# EAGLE design tpa6120-v1_0_0_0-optim (EAGLE 6.4)
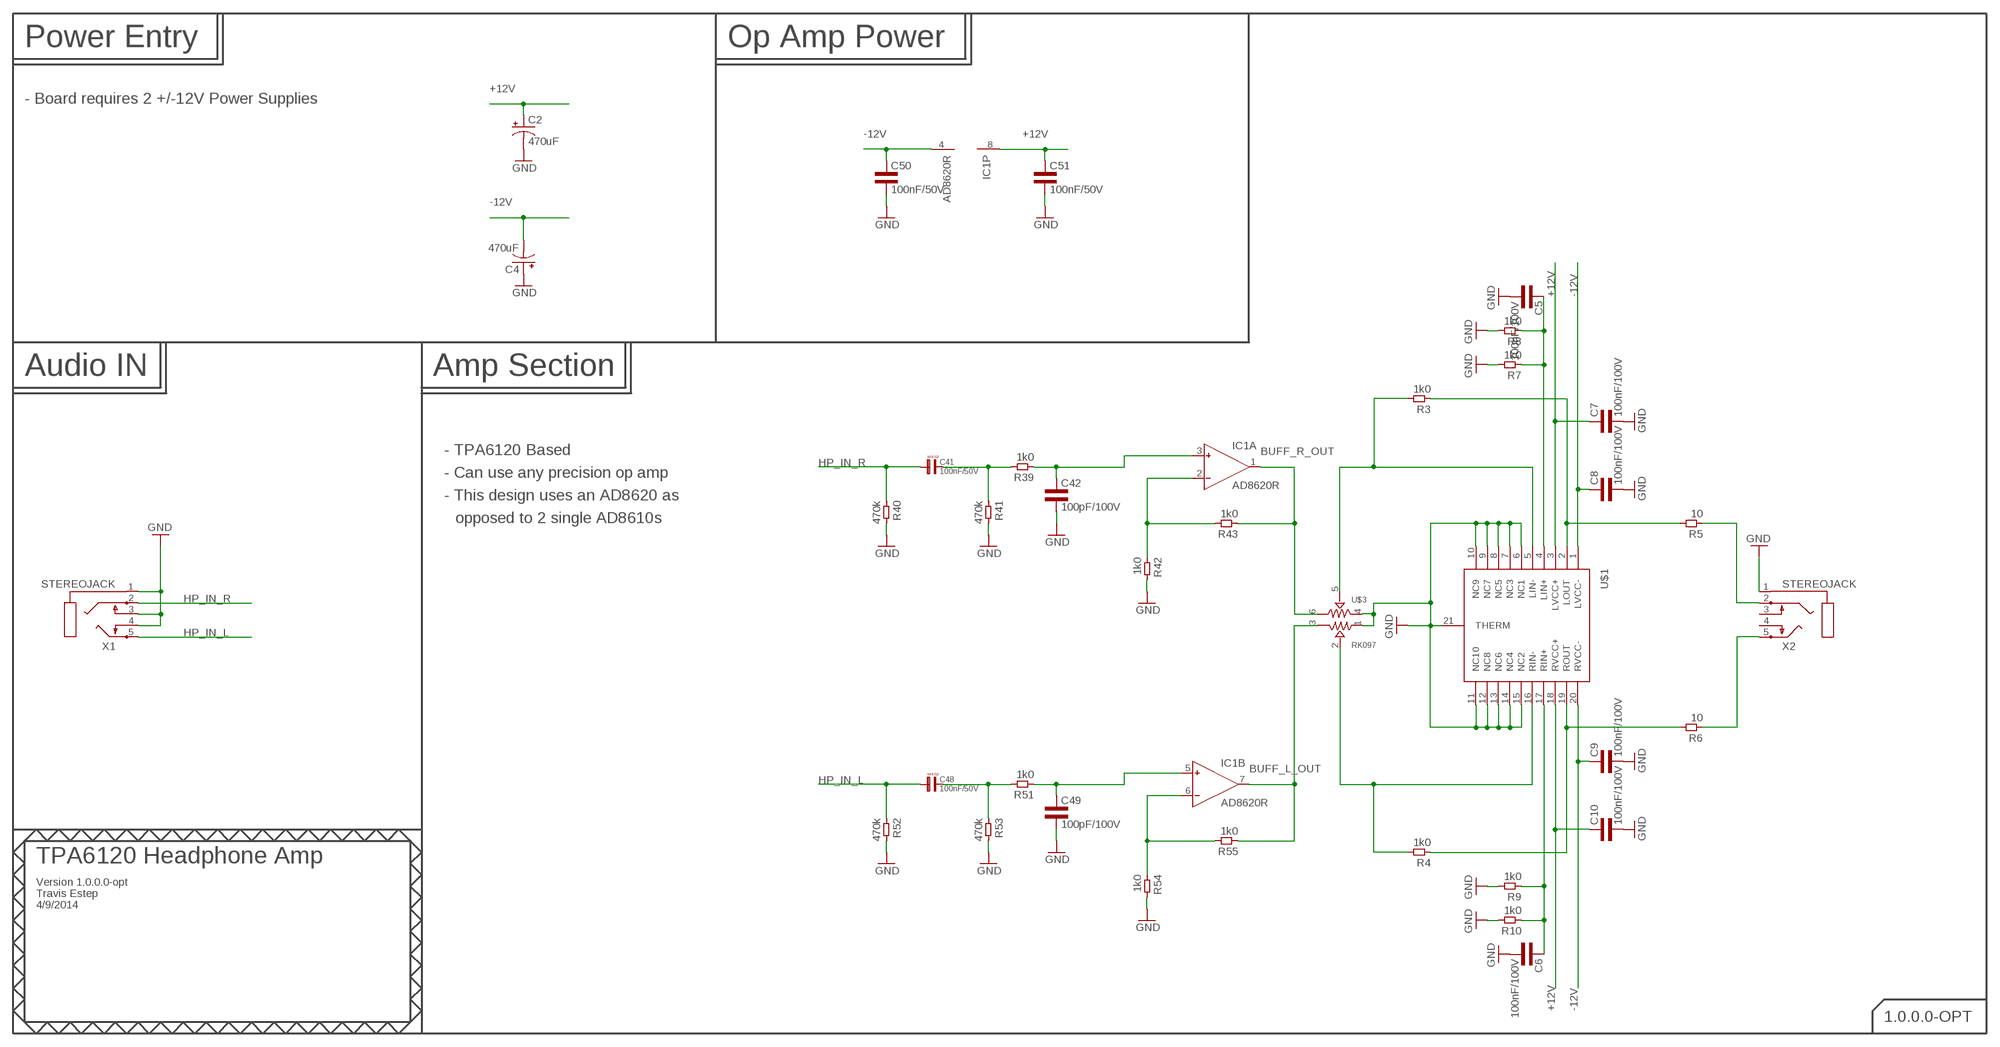
[diagram p0: schematic, sheet 1]

## Parts
C2  470uF  CPOL-USE5-10.5  [E5-10,5]
C4  470uF  CPOL-USE5-10.5  [E5-10,5]
C5  100nF/100V  CAP0603L3  [0603L3]
C6  100nF/100V  CAP0603L3  [0603L3]
C7  100nF/100V  CAP0603L3  [0603L3]
C8  100nF/100V  CAP0603L3  [0603L3]
C9  100nF/100V  CAP0603L3  [0603L3]
C10  100nF/100V  CAP0603L3  [0603L3]
C41  100nF/50V  0,1µF  [R5B2K5]
C42  100pF/100V  CAP0603L3  [0603L3]
C48  100nF/50V  0,1µF  [R5B2K5]
C49  100pF/100V  CAP0603L3  [0603L3]
C50  100nF/50V  CAP0603L3  [0603L3]
C51  100nF/50V  CAP0603L3  [0603L3]
IC1  AD8620R  [SO8]
R3  1k0  RES0603L3  [0603L3]
R4  1k0  RES0603L3  [0603L3]
R5  10  RES1206L3  [1206L3]
R6  10  RES1206L3  [1206L3]
R7  1k0  RES0603L3  [0603L3]
R8  1k0  RES0603L3  [0603L3]
R9  1k0  RES0603L3  [0603L3]
R10  1k0  RES0603L3  [0603L3]
R39  1k0  RES0603L3  [0603L3]
R40  470k  RES0603L3  [0603L3]
R41  470k  RES0603L3  [0603L3]
R42  1k0  RES0603L3  [0603L3]
R43  1k0  RES0603L3  [0603L3]
R51  1k0  RES0603L3  [0603L3]
R52  470k  RES0603L3  [0603L3]
R53  470k  RES0603L3  [0603L3]
R54  1k0  RES0603L3  [0603L3]
R55  1k0  RES0603L3  [0603L3]
U$1  TPA6120_TPA6120  [TPA6120_TPA6120]
U$3  RK097  [RK097]
X1  STEREOJACK  [STX3100]
X2  STEREOJACK  [STX3100]

## Nets
+12V: C2.+ C7.P$1 C10.P$1 C51.P$1 IC1.8(P:V+) U$1.3(LVCC+) U$1.18(RVCC+)
-12V: C4.- C8.P$1 C9.P$1 C50.P$1 IC1.4(P:V-) U$1.1(LVCC-) U$1.20(RVCC-)
BUFF_L_OUT: IC1.7(B:OUT) R55.P$1 U$3.3
BUFF_R_OUT: IC1.1(A:OUT) R43.P$1 U$3.6
GND: C2.- C4.+ C5.P$2 C6.P$2 C7.P$2 C8.P$2 C9.P$2 C10.P$2 C42.P$2 C49.P$2 C50.P$2 C51.P$2 R7.P$2 R8.P$2 R9.P$2 R10.P$2 R40.P$2 R41.P$2 R42.P$2 R52.P$2 R53.P$2 R54.P$2 U$1.6(NC1) U$1.7(NC3) U$1.8(NC5) U$1.9(NC7) U$1.10(NC9) U$1.11(NC10) U$1.12(NC8) U$1.13(NC6) U$1.14(NC4) U$1.15(NC2) U$1.21(THERM) U$3.1 U$3.4 X1.1 X1.3 X1.4 X2.1
HP_IN_L: C48.1 R52.P$1 X1.5
HP_IN_R: C41.1 R40.P$1 X1.2
HP_OUT_L: R6.1 X2.5
HP_OUT_R: R5.1 X2.2
INVERT_L: R3.P$2 U$1.5(LIN-) U$3.5
INVERT_R: R4.P$2 U$1.16(RIN-) U$3.2
N$19: C5.P$1 R7.P$1 R8.P$1 U$1.4(LIN+)
N$20: C6.P$1 R9.P$1 R10.P$1 U$1.17(RIN+)
N$30: C41.2 R39.P$2 R41.P$1
N$31: C42.P$1 IC1.3(A:IN+) R39.P$1
N$32: IC1.2(A:IN-) R42.P$1 R43.P$2
N$39: C48.2 R51.P$2 R53.P$1
N$40: C49.P$1 IC1.5(B:IN+) R51.P$1
N$41: IC1.6(B:IN-) R54.P$1 R55.P$2
OUT_L: R4.P$1 R6.2 U$1.19(ROUT)
OUT_R: R3.P$1 R5.2 U$1.2(LOUT)
Unconnected: X2.3 X2.4

## Notes on the sheet
- Power Entry | Op Amp Power
- - Board requires 2 +/-12V Power Supplies
- Audio IN | Amp Section
- - TPA6120 Based
- - Can use any precision op amp
- - This design uses an AD8620 as
- opposed to 2 single AD8610s
- TPA6120 Headphone Amp
- Version 1.0.0.0-opt
- Travis Estep
- 4/9/2014
- 1.0.0.0-OPT

## Library data of the parts
C2 C4 = rcl:CPOL-US: POLARIZED CAPACITOR, American symbol
C5-C10 C42 C49-C51 = common:CAP
C41 C48 = Capacitor-Wima-MKS2-63v:0,1µF
IC1 = analog-devices:AD8620: Precision, Very Low Noise, Low Input Bias Current, Wide Bandwidth JFET Operational Amplifiers Source: http://www.analog.com/static/imported-files/data_sheets/AD8610_8620.pdf; MF: ALTERA CORPORATION; MPN: AD8620ARZ; OC_FARNELL: 9994386; OC_NEWARK: 59K6972
R3-R10 R39-R43 R51-R55 = common:RES
U$1 = amp:TPA6120_TPA6120
U$3 = SparkFun-Electromechanical:RK097
X1 X2 = adafruit:STEREOJACK: MIC/HEADPHONE JACK Stereo jack with two switches. Kycon STX3100, CUI SJ1-3555NG and/or 4UCon 05544

## Board
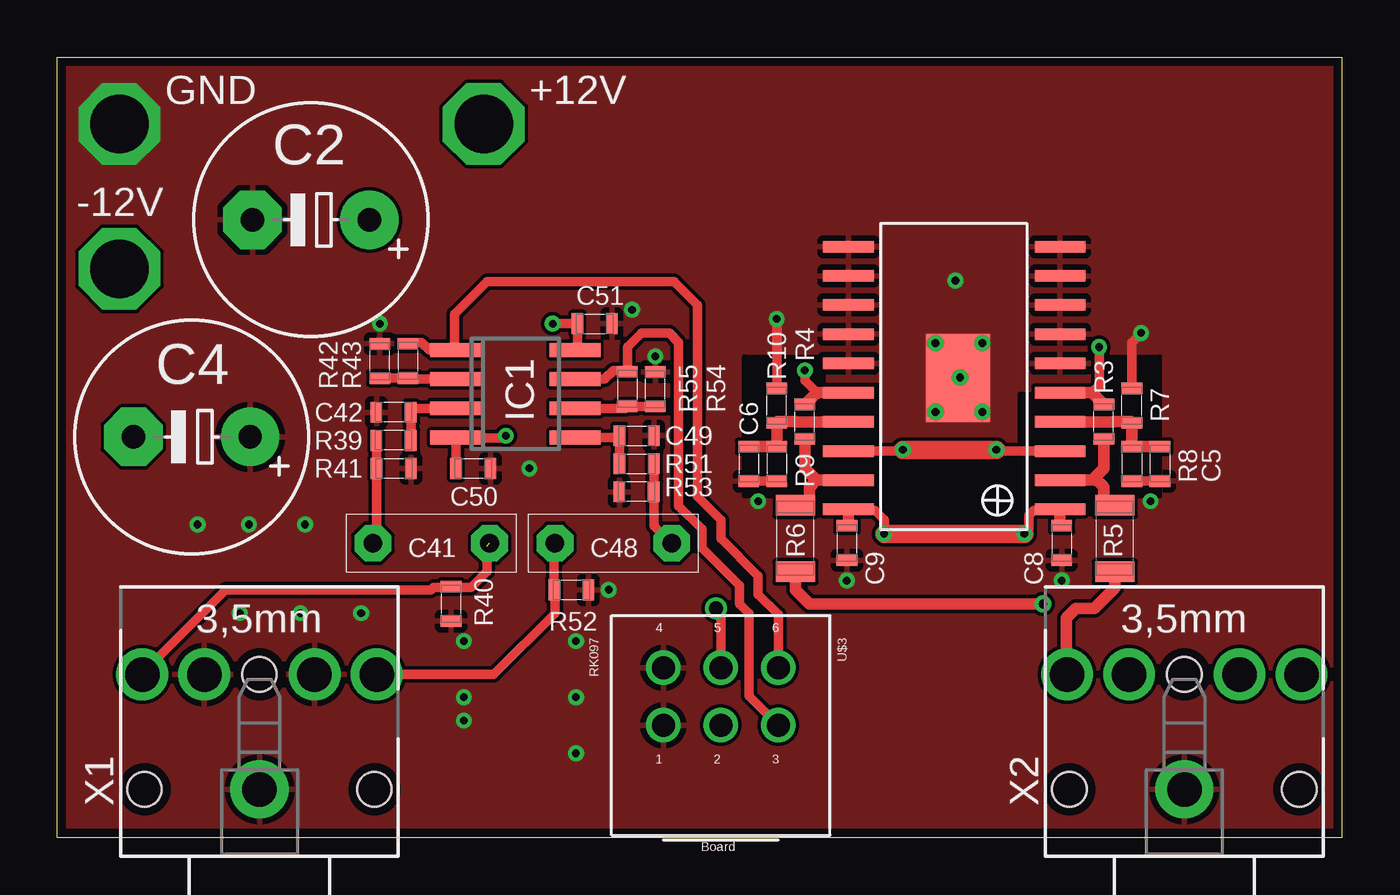
[diagram p1: board, top side]
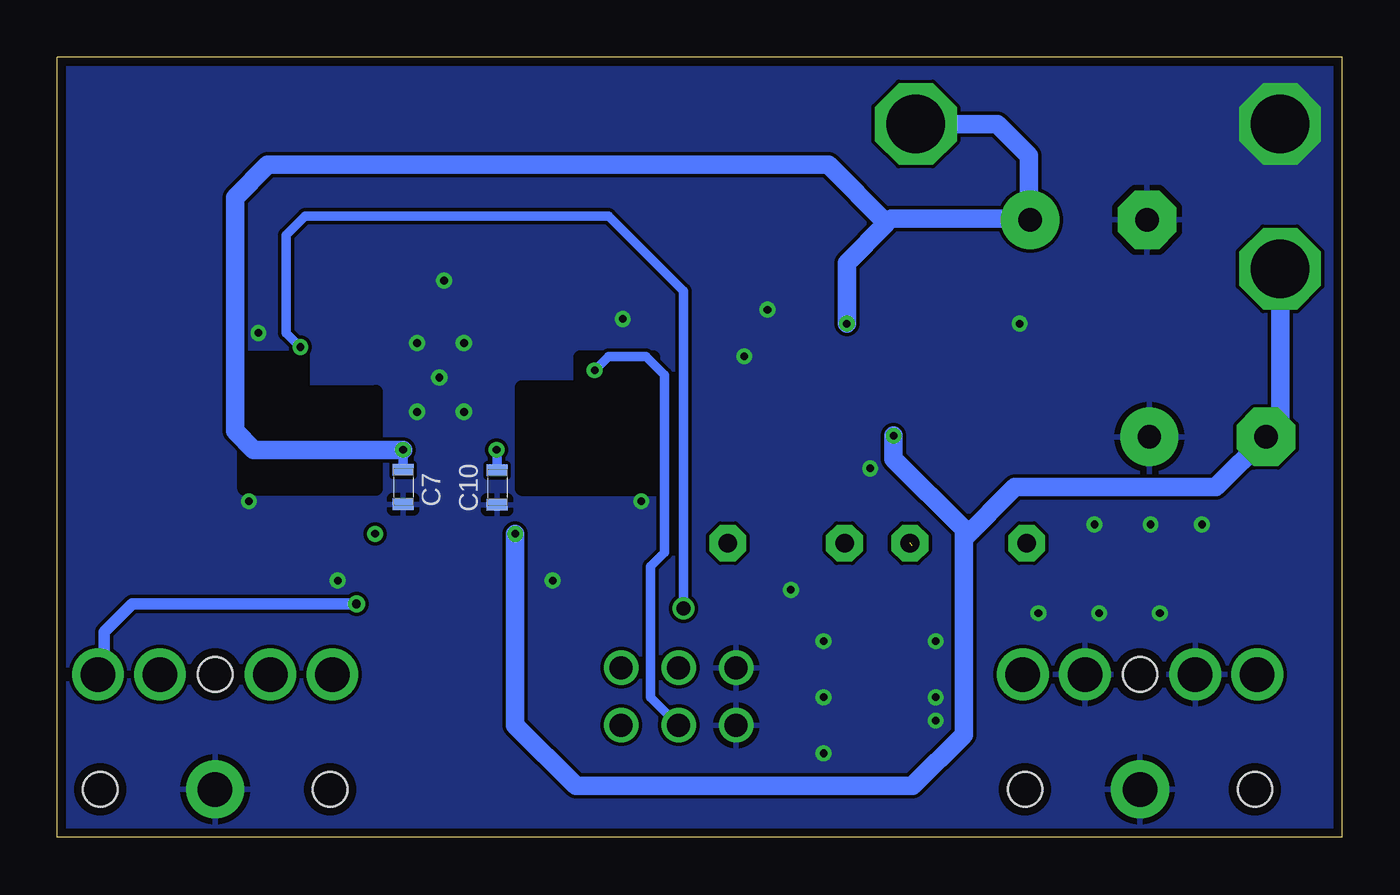
[diagram p2: board, bottom side, seen from below]

Size 55.88 x 33.93 mm. Coordinates in mm from the lower left corner, seen from the top.
Outline: 0,0 55.88,0 55.88,33.93 0,33.93 0,0
Copper layers (1*16): Top 0.0356mm / dielectric 1.5011mm / Bottom 0.0356mm
Design rules "LaenPCBOrder *": minimum track width 6mil, minimum drill 13mil, track to track 6mil, track to pad 6mil, pad to pad 6mil, via to via 6mil, smd to smd 6mil, copper to edge 15mil, drill to drill 6mil, minimum pad ring 7mil, minimum via ring 7mil, stop-mask expansion 3mil, vias tented up to drill 16mil, thermal gap 10mil
tRestrict: area 41.9,14.8 to 48,20.9; area 29.9,14.8 to 35.8,20.9
bRestrict: area 42,15.2 to 47.8,20.9; area 30,15.2 to 35.7,20.9

### Footprints (pad centres in the part's own frame; a part is rotated, then mirrored left to right if it is on the bottom)
E5-10,5 = drill 1.016 pad 2.54: + -2.54,0 | drill 1.016 pad 2.54 octagon: - 2.54,0
0603L3 = smd 0.5 x 0.9: P$1 -0.75,0; P$2 0.75,0
R5B2K5 = drill 0.813 pad 1.6 octagon: 1 -2.54,0; 2 2.54,0
SO8 = smd 0.6 x 2.2: 1 -1.905,-2.6; 2 -0.635,-2.6; 3 0.635,-2.6; 4 1.905,-2.6; 5 1.905,2.6; 6 0.635,2.6; 7 -0.635,2.6; 8 -1.905,2.6
1206L3 = smd 0.9 x 1.7: 1 -1.45,0; 2 1.45,0
TPA6120_TPA6120 = smd 0.5 x 2.2: 1 0.25,1.095; 2 1.52,1.095; 3 2.79,1.095; 4 4.06,1.095; 5 5.33,1.095; 6 6.6,1.095; 7 7.87,1.095; 8 9.14,1.095; 9 10.41,1.095; 10 11.68,1.095; 11 11.68,10.295; 12 10.41,10.295; 13 9.14,10.295; 14 7.87,10.295; 15 6.6,10.295; 16 5.33,10.295; 17 4.06,10.295; 18 2.79,10.295; 19 1.52,10.295; 20 0.25,10.295 | smd 3.81 x 2.79: 21 5.965,5.54
RK097 = drill 1: 1 2.5,0; 2 0,0; 3 -2.5,0; 4 2.5,-2.5; 5 0,-2.5; 6 -2.5,-2.5
STX3100 = drill 1.5 pad 2.54: 1 2.7,-0.1 | drill 1.5: 2 7.7,5; 3 7.7,2.3; 4 7.7,-2.5; 5 7.7,-5.2 | hole 1.5: 2.7,4.9; 2.7,-5.1; 7.7,-0.1

### Placement (x,y rotation side)
C2  11.02,26.87 180 top
C4  5.84,17.42 180 top
C5  47.96,16.26 270 top
C6  30.07,16.26 270 top
C7  40.84,15.24 270 bottom
C8  43.69,12.8 270 top
C9  34.34,12.8 270 top
C10  36.75,15.21 270 bottom
C41  16.26,12.8 180 top
C42  14.63,18.49 180 top
C48  24.18,12.8 0 top
C49  25.2,17.48 0 top
C50  18.08,16.05 0 top
C51  23.37,22.35 0 top
IC1  19.91,19.3 270 top
R3  45.52,18.08 90 top
R4  32.51,18.08 90 top
R5  46,13 90 top
R6  32.11,13 90 top
R7  46.74,18.8 90 top
R8  46.74,16.26 270 top
R9  31.29,16.26 270 top
R10  31.29,18.8 90 top
R39  14.63,17.27 180 top
R40  17.12,10.16 270 top
R41  14.63,16.05 0 top
R42  14.02,20.73 90 top
R43  15.24,20.73 270 top
R51  25.2,16.26 0 top
R52  22.35,10.77 0 top
R53  25.2,15.04 180 top
R54  26.01,19.51 90 top
R55  24.79,19.51 270 top
U$1  44.7,14.02 90 top
U$3  28.85,4.88 180 top
X1  8.69,-0.61 90 top
X2  48.92,-0.61 90 top

### Tracks (layer width: path | path; a pad name or v marks a point on that pad's centre or on a via)
+12V  (via drill 0.33, 2.54)
  Top 0.406: IC1.8 22.62,21.31 C51.P$1 v21.54,22.35 | U$1.18 36.73,16.81 v36.78,16.87 | U$1.3 40.9,16.81 v40.84,16.87
  Top 0.813: v36.78,16.87 v40.84,16.87
  Bottom 0.406: 13.61,26.92 C2.+ | C10.P$1 36.75,16.84 v36.78,16.87 | C7.P$1 v40.84,16.87
  Bottom 0.813: v18.54,31.04 14.99,31.04 13.61,29.67 13.61,26.92 19.61,26.92 19.81,26.72 | 19.81,26.72 21.54,24.99 v21.54,22.35 | v40.84,16.87 47.35,16.87 48.16,17.68 48.16,27.84 46.74,29.26 22.35,29.26 19.81,26.72
-12V  (via drill 0.33, 2.54)
  Top 0.406: C50.P$1 17.34,17.38 | 17.34,17.38 IC1.4 | 17.34,17.38 19.41,17.38 v19.51,17.48 | U$1.1 43.56,14.22 42.47,14.22 42.27,14.02 42.27,13.41 v42.06,13.21 | v35.97,13.21 35.97,13.82 35.56,14.22 34.46,14.22 U$1.20
  Top 0.508: U$1.20 34.41,13.62 C9.P$1 | U$1.1 43.61,13.63 C8.P$1
  Top 0.813: v42.06,13.21 v35.97,13.21
  Bottom 0.406: 3.25,17.48 C4.-
  Bottom 0.813: 16.46,13.01 14.22,15.24 5.49,15.24 C4.- 2.69,18.03 v2.69,24.74 | 16.46,13.01 16.46,4.47 18.69,2.24 33.33,2.24 35.97,4.88 v35.97,13.21 | 16.46,13.01 16.46,13.41 19.51,16.46 v19.51,17.48
BUFF_L_OUT
  Top 0.406: IC1.7 23.8,19.94 24.18,20.32 24.73,20.32 R55.P$1 24.79,21.34 25.4,21.95 26.62,21.95 27.03,21.54 27.03,14.43 28.04,13.41 28.04,12.6 29.67,10.97 29.67,10.16 30.07,9.75 30.07,6.16 U$3.3
BUFF_R_OUT
  Top 0.406: R43.P$1 15.3,21.54 15.85,21.54 16.18,21.21 IC1.1 17.27,21.25 17.27,22.76 18.69,24.18 26.82,24.18 27.84,23.17 27.84,14.83 28.85,13.82 28.85,13.01 30.48,11.38 30.48,10.57 31.35,9.69 U$3.6
GND  (via drill 0.33, 0.35, 2.54)
  Top 0.406: R8.P$2 C5.P$2 | R10.P$2 v31.29,22.56 | R7.P$2 46.74,21.54 v47.14,21.95 | C6.P$2 R9.P$2
  other vias: 38.2,21.51 38.2,18.52 40.23,18.52 40.23,21.51 39.07,24.23 39.27,20.02 2.69,31.04 26.01,20.93 34.34,11.18 43.69,11.18 6.1,13.61 8.33,13.61 10.77,13.61 7.92,9.75 10.57,9.75 13.21,9.75 17.68,8.53 23.98,10.77 30.48,14.63 20.52,16.05 17.68,6.1 17.68,5.08 22.56,8.53 22.56,6.1 22.56,3.66 47.55,14.63 14.02,22.35 24.99,22.96
  pour Top (no thermals): 37.19,22.56 41.45,22.56 41.45,17.68 37.19,17.68
  pour Bottom: 0.41,33.53 0.41,0.41 55.47,0.41 55.47,33.53
  pour Top: 0.41,33.53 0.41,0.41 55.47,0.41 55.47,33.53
HP_IN_L
  Top 0.406: X1.5 18.98,7.09 21.64,9.75 21.64,10.73 R52.P$1 21.6,12.74 C48.1
HP_IN_R  (1 unrouted)
  Top 0.406: X1.2 3.69,7.14 7.32,10.77 16.26,10.77 16.36,10.87 17.08,10.87 R40.P$1 17.16,10.87 17.98,10.87 18.68,11.57 18.68,12.69
HP_OUT_L  (via drill 0.38)
  Top 0.508: R6.1 32.11,10.77 32.72,10.16 v42.88,10.16
  Bottom 0.508: v42.88,10.16 52.63,10.16 53.85,8.94 53.85,7.36 X2.5
HP_OUT_R
  Top 0.508: R5.1 46,10.85 45.11,9.96 44.3,9.96 43.89,9.55 43.89,7.12 X2.2
INVERT_L  (via drill 0.33, 0.6)
  Top 0.406: U$3.5 28.85,9.75 v28.65,9.96 | v45.31,21.34 45.31,19.66 45,19.35
  Top 0.508: U$1.5 45,19.35 R3.P$2
  Bottom 0.406: v28.65,9.96 28.65,23.77 31.9,27.03 45.11,27.03 45.92,26.21 45.92,21.95 v45.31,21.34
INVERT_R  (via drill 0.33)
  Top 0.406: v32.51,20.32 32.51,19.87 33.03,19.35
  Top 0.508: U$1.16 33.03,19.35 R4.P$2
  Bottom 0.406: U$3.2 30.07,6.1 30.07,11.79 29.46,12.4 29.46,20.12 30.28,20.93 31.9,20.93 v32.51,20.32
N$19
  Top 0.508: U$1.4 45.92,18.08 45.92,18.09 46.7,18.09 R7.P$1 R8.P$1 C5.P$1
N$20
  Top 0.508: U$1.17 32.11,18.08 32.11,18.09 31.33,18.09 R10.P$1 R9.P$1 C6.P$1
N$30
  Top 0.406: R39.P$2 R41.P$1 13.88,12.97 C41.2
N$31
  Top 0.406: IC1.3 15.56,18.67 C42.P$1 R39.P$1
N$32
  Top 0.406: R42.P$1 R43.P$2 15.28,19.94 IC1.2
N$39
  Top 0.406: R51.P$2 R53.P$1 25.95,13.55 C48.2
N$40
  Top 0.406: IC1.5 24.37,17.4 C49.P$1 R51.P$1
N$41
  Top 0.406: IC1.6 24.7,18.67 R55.P$2 R54.P$1
OUT_L
  Top 0.508: U$1.19 33.02,15.54 | 33.02,15.54 32.51,16.05 R4.P$1 | R6.2 32.69,14.46 32.72,14.43 32.72,15.23 33.02,15.54
OUT_R
  Top 0.508: U$1.2 45.01,15.54 45.11,15.65 | 45.11,15.65 45.52,16.05 R3.P$1 | R5.2 45.54,14.46 45.52,14.43 45.52,15.24 45.11,15.65

### Text on the board
tPlace: GND | +12V | -12V